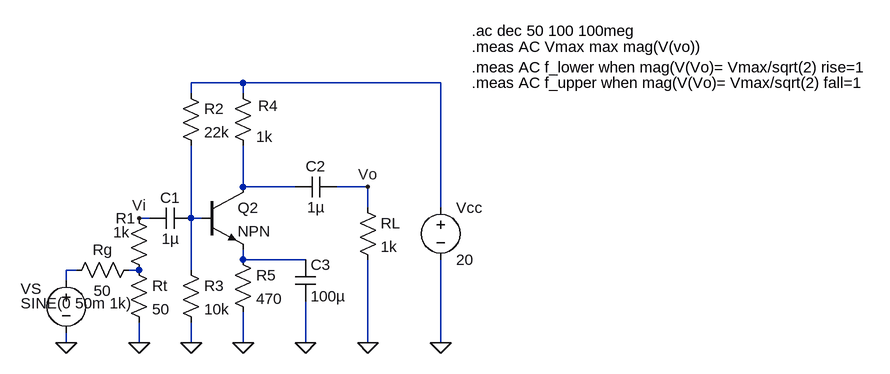
[diagram p0: schematic P3.asc]
P3.asc, the LTspice schematic file:
Version 4
SHEET 1 1604 680
WIRE 448 128 368 128
WIRE 752 128 448 128
WIRE 368 144 368 128
WIRE 448 144 448 128
WIRE 448 288 448 224
WIRE 528 288 448 288
WIRE 640 288 592 288
WIRE 640 320 640 288
WIRE 752 320 752 128
WIRE 304 336 288 336
WIRE 368 336 368 224
WIRE 384 336 368 336
WIRE 448 400 448 384
WIRE 544 400 448 400
WIRE 192 416 176 416
WIRE 288 416 272 416
WIRE 368 416 368 336
WIRE 176 432 176 416
WIRE 176 528 176 512
WIRE 288 528 288 496
WIRE 368 528 368 496
WIRE 448 528 448 480
WIRE 544 528 544 464
WIRE 640 528 640 400
WIRE 752 528 752 400
FLAG 752 528 0
FLAG 640 528 0
FLAG 544 528 0
FLAG 448 528 0
FLAG 368 528 0
FLAG 288 528 0
FLAG 176 528 0
FLAG 640 288 Vo
FLAG 288 336 Vi
SYMBOL voltage 752 304 R0
SYMATTR InstName Vcc
SYMATTR Value 20
SYMBOL Res 624 304 R0
SYMATTR InstName RL
SYMATTR Value 1k
SYMBOL Cap 592 272 R90
WINDOW 0 0 32 VBottom 2
WINDOW 3 32 32 VTop 2
SYMATTR InstName C2
SYMATTR Value 1µ
SYMBOL Res 464 240 R180
WINDOW 0 -38 77 Left 2
WINDOW 3 -30 29 Left 2
SYMATTR InstName R4
SYMATTR Value 1k
SYMBOL Cap 528 400 R0
SYMATTR InstName C3
SYMATTR Value 100µ
SYMBOL Res 432 384 R0
SYMATTR InstName R5
SYMATTR Value 470
SYMBOL npn 384 288 R0
SYMATTR InstName Q2
SYMBOL Res 352 400 R0
SYMATTR InstName R3
SYMATTR Value 10k
SYMBOL Res 272 400 R0
SYMATTR InstName Rt
SYMATTR Value 50
SYMBOL Res 272 320 R0
WINDOW 0 -20 16 Left 2
WINDOW 3 -24 38 Left 2
SYMATTR InstName R1
SYMATTR Value 1k
SYMBOL voltage 176 416 R0
WINDOW 0 -70 29 Left 2
WINDOW 3 -70 51 Left 2
SYMATTR InstName VS
SYMATTR Value SINE(0 50m 1k)
SYMATTR Value2 AC 50m
SYMBOL Cap 368 320 R90
WINDOW 0 0 32 VBottom 2
WINDOW 3 32 32 VTop 2
SYMATTR InstName C1
SYMATTR Value 1µ
SYMBOL Res 352 128 R0
SYMATTR InstName R2
SYMATTR Value 22k
SYMBOL Res 288 400 R90
WINDOW 0 0 56 VBottom 2
WINDOW 3 32 56 VTop 2
SYMATTR InstName Rg
SYMATTR Value 50
TEXT 800 48 Left 2 !.ac dec 50 100 100meg
TEXT 800 72 Left 2 !.meas AC Vmax max mag(V(vo))
TEXT 800 104 Left 2 !.meas AC f_lower when mag(V(Vo)= Vmax/sqrt(2) rise=1
TEXT 800 128 Left 2 !.meas AC f_upper when mag(V(Vo)= Vmax/sqrt(2) fall=1

The netlist it stands for:
* P3.asc
Vcc N001 0 20
RL Vo 0 1k
C2 Vo N002 1µ
R4 N002 N001 1k
C3 N004 0 100µ
R5 N004 0 470
Q2 N002 N003 N004 0 NPN
R3 N003 0 10k
Rt N006 0 50
R1 Vi N006 1k
VS N005 0 SINE(0 50m 1k) AC 50m
C1 N003 Vi 1µ
R2 N001 N003 22k
Rg N006 N005 50
.model NPN NPN
.model PNP PNP
.lib standard.bjt
.ac dec 50 100 100meg
.meas AC Vmax max mag(V(vo))
.meas AC f_lower when mag(V(Vo)= Vmax/sqrt(2) rise=1
.meas AC f_upper when mag(V(Vo)= Vmax/sqrt(2) fall=1
.backanno
.end